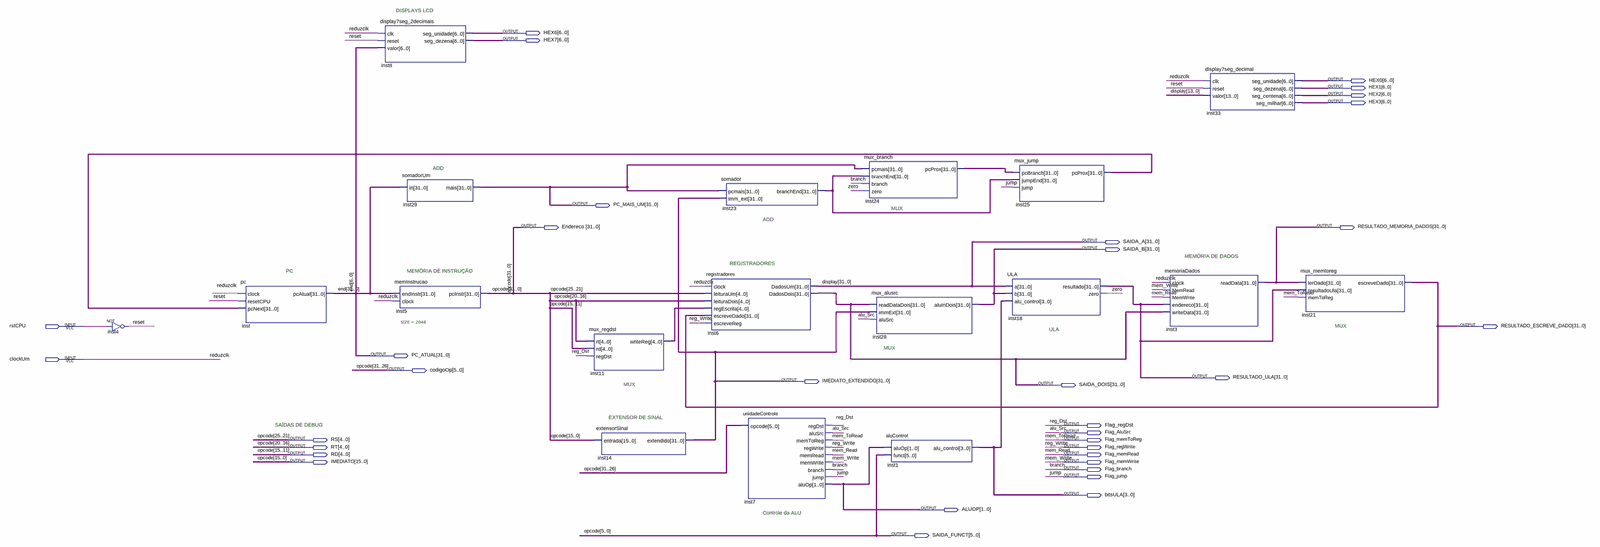
[diagram p0: schematic sheet, whole]
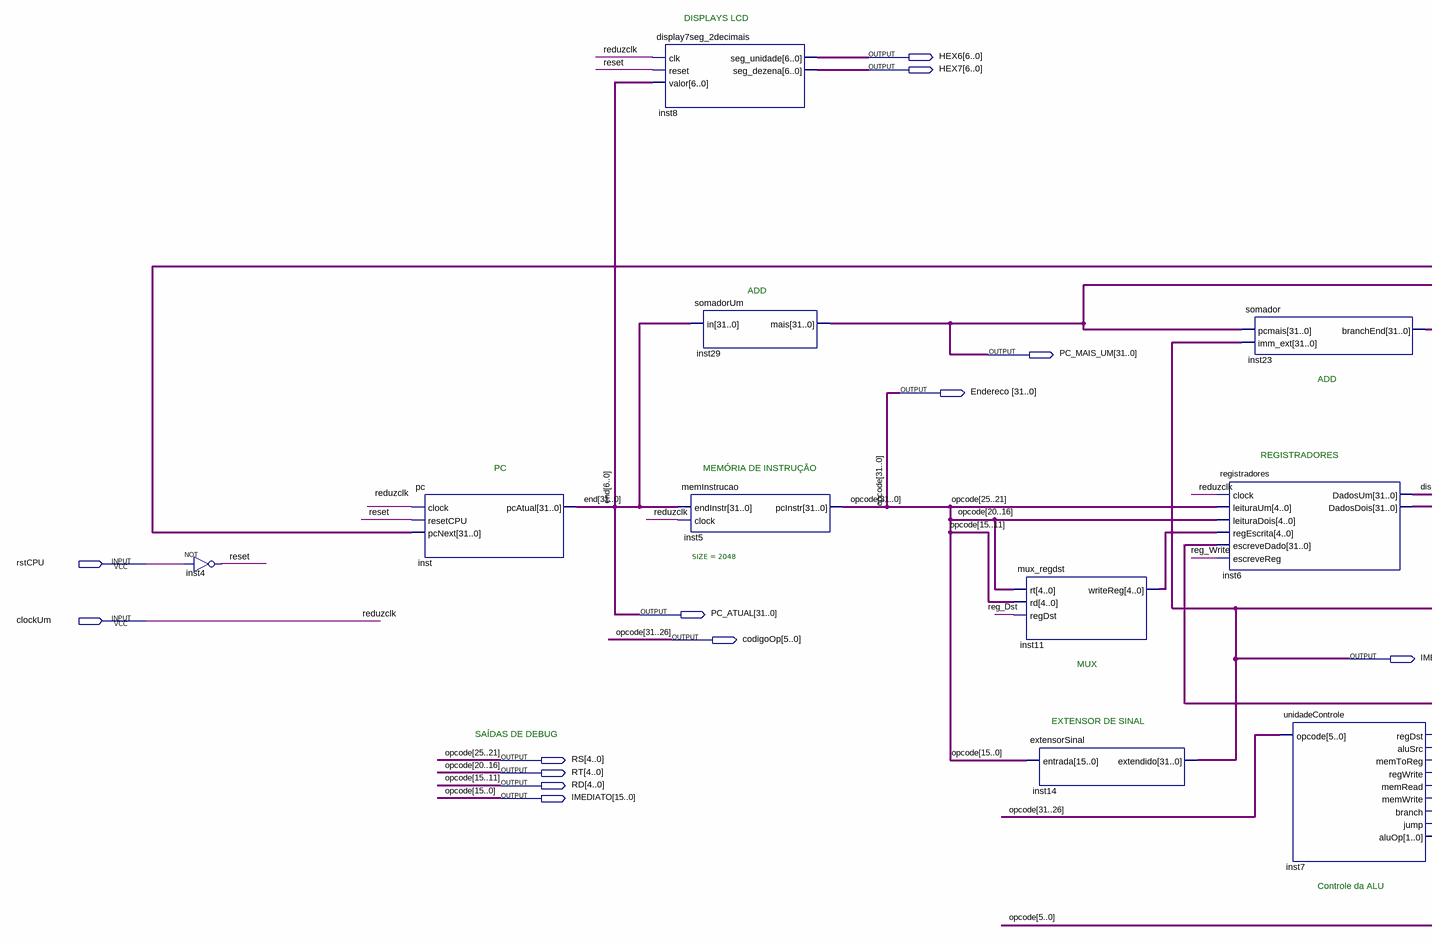
[diagram p1: schematic sheet, left part]
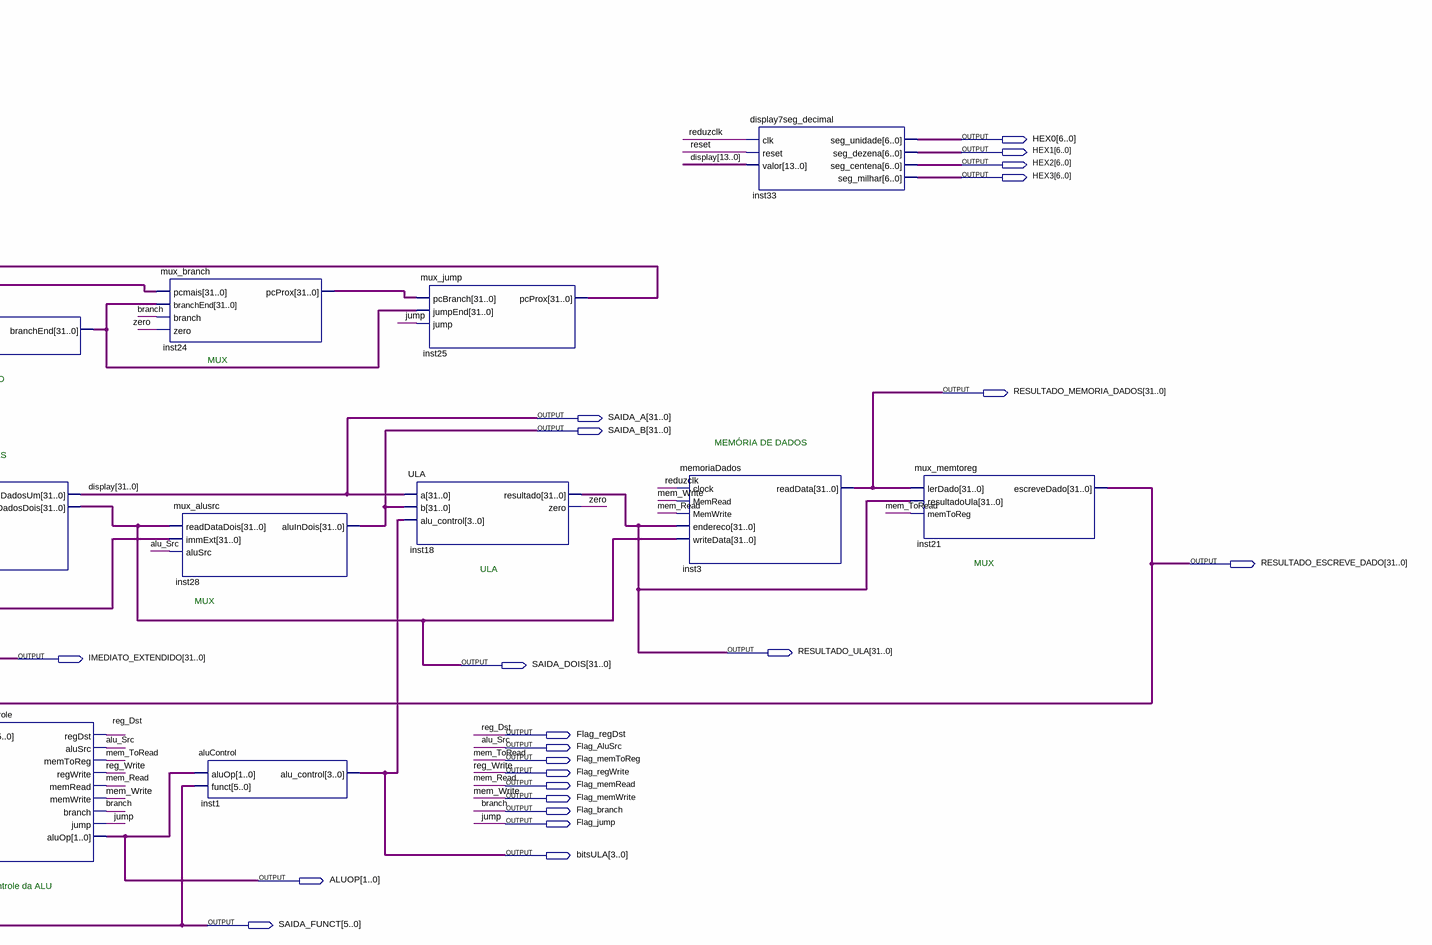
[diagram p2: schematic sheet, right part]
// Quartus schematic processadorSO.bdf as structural Verilog: 18 symbols, 34 pins
module processadorSO (
  input  rstCPU,
  input  clockUm,
  output [6:0] HEX6,
  output [6:0] HEX7,
  output [6:0] HEX0,
  output [6:0] HEX1,
  output [6:0] HEX2,
  output [6:0] HEX3,
  output [31:0] PC_MAIS_UM,
  output [31:0] Endereco,
  output [31:0] RESULTADO_MEMORIA_DADOS,
  output [31:0] SAIDA_A,
  output [31:0] SAIDA_B,
  output [31:0] RESULTADO_ESCREVE_DADO,
  output [31:0] PC_ATUAL,
  output [5:0] codigoOp,
  output [31:0] RESULTADO_ULA,
  output [31:0] IMEDIATO_EXTENDIDO,
  output [31:0] SAIDA_DOIS,
  output Flag_regDst,
  output Flag_AluSrc,
  output [4:0] RS,
  output Flag_memToReg,
  output [4:0] RT,
  output Flag_regWrite,
  output [4:0] RD,
  output Flag_memRead,
  output [15:0] IMEDIATO,
  output Flag_memWrite,
  output Flag_branch,
  output Flag_jump,
  output [3:0] bitsULA,
  output [1:0] ALUOP,
  output [5:0] SAIDA_FUNCT
);

  wire reset, zero;
  wire [4:0] inst11_writereg;
  wire [31:0] inst23_branchend, inst24_pcprox, inst25_pcprox;

  not inst4 (reset, rstCPU);
  pc inst (.clock(clockUm), .resetCPU(reset), .pcNext(inst25_pcprox), .pcAtual(PC_ATUAL));
  display7seg_2decimais inst8 (
    .clk(clockUm), .reset(reset), .valor(PC_ATUAL[6:0]), .seg_unidade(HEX6), .seg_dezena(HEX7));
  somadorUm inst29 (.in(PC_ATUAL), .mais(PC_MAIS_UM));
  memInstrucao #(.SIZE(2048)) inst5 (.endInstr(PC_ATUAL), .clock(clockUm), .pcInstr({codigoOp, Endereco[25:0]}));
  mux_regdst inst11 (.rt(Endereco[20:16]), .rd(Endereco[15:11]), .regDst(Flag_regDst), .writeReg(inst11_writereg));
  extensorSinal inst14 (.entrada(Endereco[15:0]), .extendido(IMEDIATO_EXTENDIDO));
  registradores inst6 (
    .clock(clockUm), .leituraUm(Endereco[25:21]), .leituraDois(Endereco[20:16]),
    .regEscrita(inst11_writereg), .escreveDado(RESULTADO_ESCREVE_DADO), .escreveReg(Flag_regWrite),
    .DadosUm(SAIDA_A), .DadosDois(SAIDA_DOIS));
  somador inst23 (.pcmais(PC_MAIS_UM), .imm_ext(IMEDIATO_EXTENDIDO), .branchEnd(inst23_branchend));
  unidadeControle inst7 (
    .opcode(codigoOp), .regDst(Flag_regDst), .aluSrc(Flag_AluSrc), .memToReg(Flag_memToReg),
    .regWrite(Flag_regWrite), .memRead(Flag_memRead), .memWrite(Flag_memWrite), .branch(Flag_branch),
    .jump(Flag_jump), .aluOp(ALUOP));
  mux_branch inst24 (
    .pcmais(PC_MAIS_UM), .branchEnd(inst23_branchend), .branch(Flag_branch), .zero(zero),
    .pcProx(inst24_pcprox));
  mux_alusrc inst28 (.readDataDois(SAIDA_DOIS), .immExt(IMEDIATO_EXTENDIDO), .aluSrc(Flag_AluSrc), .aluInDois(SAIDA_B));
  aluControl inst1 (.aluOp(ALUOP), .funct(Endereco[5:0]), .alu_control(bitsULA));
  mux_jump inst25 (.pcBranch(inst24_pcprox), .jumpEnd(inst23_branchend), .jump(Flag_jump), .pcProx(inst25_pcprox));
  ULA inst18 (.a(SAIDA_A), .b(SAIDA_B), .alu_control(bitsULA), .resultado(RESULTADO_ULA), .zero(zero));
  memoriaDados inst3 (
    .clock(clockUm), .MemRead(Flag_memWrite), .MemWrite(Flag_memRead), .endereco(RESULTADO_ULA),
    .writeData(SAIDA_DOIS), .readData(RESULTADO_MEMORIA_DADOS));
  display7seg_decimal inst33 (
    .clk(clockUm), .reset(reset), .valor(SAIDA_A[13:0]), .seg_unidade(HEX0), .seg_dezena(HEX1),
    .seg_centena(HEX2), .seg_milhar(HEX3));
  mux_memtoreg inst21 (
    .lerDado(RESULTADO_MEMORIA_DADOS), .resultadoUla(RESULTADO_ULA), .memToReg(Flag_memToReg),
    .escreveDado(RESULTADO_ESCREVE_DADO));

  assign Endereco[31:26] = codigoOp;
  assign IMEDIATO = Endereco[15:0];
  assign RD = Endereco[15:11];
  assign RS = Endereco[25:21];
  assign RT = Endereco[20:16];
  assign SAIDA_FUNCT = Endereco[5:0];

  // Other names for the same wires on the sheet: alu_Src = Flag_AluSrc; branch = Flag_branch; end[31:0] = PC_ATUAL;
  //   opcode[31:0] = {codigoOp, Endereco[25:0]}; jump = Flag_jump; mem_Read = Flag_memRead;
  //   mem_ToRead = Flag_memToReg; mem_Write = Flag_memWrite; reduzclk = clockUm; reg_Dst = Flag_regDst;
  //   reg_Write = Flag_regWrite; display[31:0] = SAIDA_A

  // Notes on the sheet:
  //   DISPLAYS LCD
  //   ADD
  //   MUX
  //   ADD
  //   MEMÓRIA DE DADOS
  //   REGISTRADORES
  //   PC
  //   MEMÓRIA DE INSTRUÇÃO
  //   MUX
  //   ULA
  //   MUX
  //   MUX
  //   EXTENSOR DE SINAL
  //   SAÍDAS DE DEBUG
  //   Controle da ALU
endmodule
